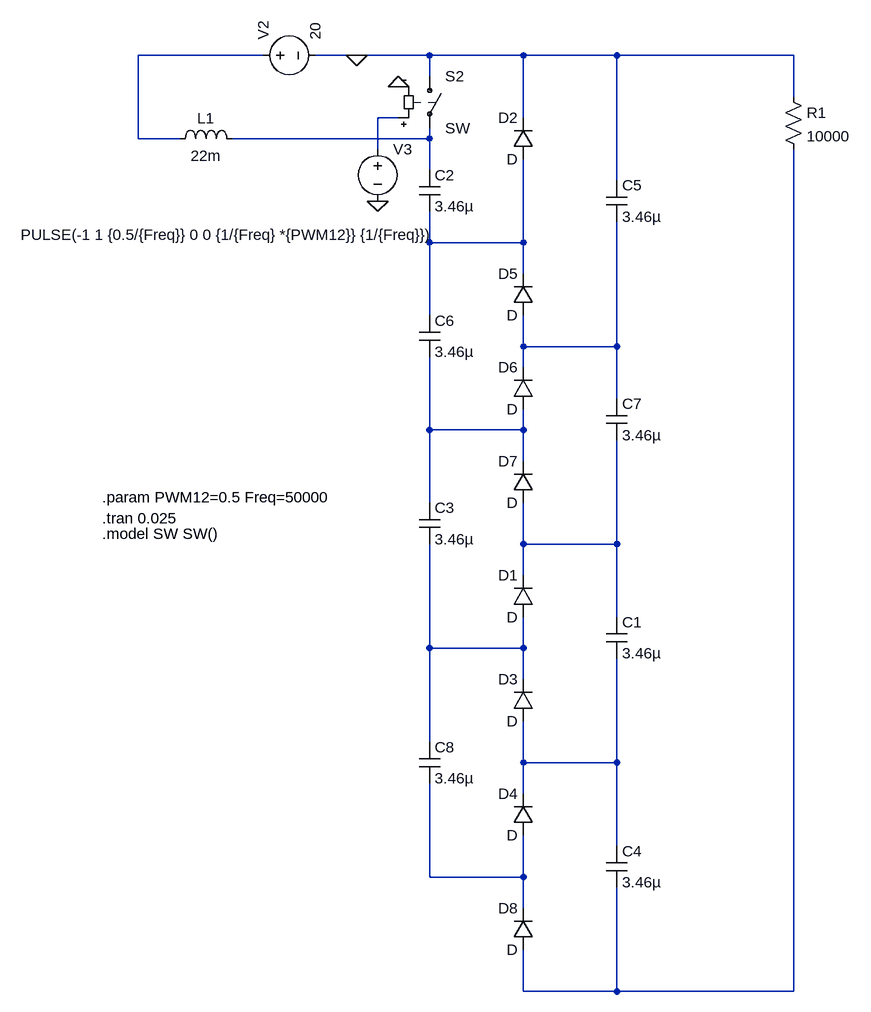
[diagram p0: schematic 3Nxsingleinvert.asc]
3Nxsingleinvert.asc, the LTspice schematic file:
Version 4
SHEET 1 1520 2424
WIRE 192 976 0 976
WIRE 336 976 272 976
WIRE 448 976 336 976
WIRE 592 976 448 976
WIRE 736 976 592 976
WIRE 1008 976 736 976
WIRE 448 1008 448 976
WIRE 1008 1040 1008 976
WIRE 400 1072 368 1072
WIRE 592 1072 592 976
WIRE 0 1104 0 976
WIRE 64 1104 0 1104
WIRE 448 1104 448 1088
WIRE 448 1104 144 1104
WIRE 368 1120 368 1072
WIRE 448 1152 448 1104
WIRE 736 1168 736 976
WIRE 448 1264 448 1216
WIRE 592 1264 592 1136
WIRE 592 1264 448 1264
WIRE 592 1312 592 1264
WIRE 448 1376 448 1264
WIRE 592 1424 592 1376
WIRE 736 1424 736 1232
WIRE 736 1424 592 1424
WIRE 592 1456 592 1424
WIRE 736 1504 736 1424
WIRE 448 1552 448 1440
WIRE 592 1552 592 1520
WIRE 592 1552 448 1552
WIRE 592 1600 592 1552
WIRE 448 1664 448 1552
WIRE 592 1728 592 1664
WIRE 736 1728 736 1568
WIRE 736 1728 592 1728
WIRE 592 1776 592 1728
WIRE 736 1840 736 1728
WIRE 448 1888 448 1728
WIRE 592 1888 592 1840
WIRE 592 1888 448 1888
WIRE 592 1936 592 1888
WIRE 448 2032 448 1888
WIRE 592 2064 592 2000
WIRE 736 2064 736 1904
WIRE 736 2064 592 2064
WIRE 592 2112 592 2064
WIRE 736 2192 736 2064
WIRE 448 2240 448 2096
WIRE 592 2240 592 2176
WIRE 592 2240 448 2240
WIRE 592 2288 592 2240
WIRE 592 2416 592 2352
WIRE 736 2416 736 2256
WIRE 736 2416 592 2416
WIRE 1008 2416 1008 1120
WIRE 1008 2416 736 2416
FLAG 400 1024 0
FLAG 336 976 0
FLAG 368 1200 0
SYMBOL voltage 176 976 R270
WINDOW 123 0 0 Left 2
WINDOW 39 0 0 Left 2
SYMATTR InstName V2
SYMATTR Value 20
SYMBOL sw 448 992 R0
SYMATTR InstName S2
SYMBOL ind 48 1120 R270
WINDOW 0 32 56 VTop 2
WINDOW 3 5 56 VBottom 2
SYMATTR InstName L1
SYMATTR Value 22m
SYMBOL cap 432 1152 R0
SYMATTR InstName C2
SYMATTR Value 3.46µ
SYMBOL cap 720 1168 R0
SYMATTR InstName C5
SYMATTR Value 3.46µ
SYMBOL diode 608 1136 R180
WINDOW 0 24 64 Left 2
WINDOW 3 24 0 Left 2
SYMATTR InstName D2
SYMBOL diode 608 1376 R180
WINDOW 0 24 64 Left 2
WINDOW 3 24 0 Left 2
SYMATTR InstName D5
SYMBOL diode 608 1520 R180
WINDOW 0 24 64 Left 2
WINDOW 3 24 0 Left 2
SYMATTR InstName D6
SYMBOL diode 608 1664 R180
WINDOW 0 24 64 Left 2
WINDOW 3 24 0 Left 2
SYMATTR InstName D7
SYMBOL cap 432 1376 R0
SYMATTR InstName C6
SYMATTR Value 3.46µ
SYMBOL cap 720 1504 R0
SYMATTR InstName C7
SYMATTR Value 3.46µ
SYMBOL res 992 1024 R0
SYMATTR InstName R1
SYMATTR Value 10000
SYMBOL voltage 368 1104 R0
WINDOW 3 -549 148 Left 2
WINDOW 123 0 0 Left 2
WINDOW 39 0 0 Left 2
SYMATTR Value PULSE(-1 1 {0.5/{Freq}} 0 0 {1/{Freq} *{PWM12}} {1/{Freq}})
SYMATTR InstName V3
SYMBOL diode 608 1840 R180
WINDOW 0 24 64 Left 2
WINDOW 3 24 0 Left 2
SYMATTR InstName D1
SYMBOL diode 608 2000 R180
WINDOW 0 24 64 Left 2
WINDOW 3 24 0 Left 2
SYMATTR InstName D3
SYMBOL cap 720 1840 R0
SYMATTR InstName C1
SYMATTR Value 3.46µ
SYMBOL cap 432 1664 R0
SYMATTR InstName C3
SYMATTR Value 3.46µ
SYMBOL diode 608 2176 R180
WINDOW 0 24 64 Left 2
WINDOW 3 24 0 Left 2
SYMATTR InstName D4
SYMBOL diode 608 2352 R180
WINDOW 0 24 64 Left 2
WINDOW 3 24 0 Left 2
SYMATTR InstName D8
SYMBOL cap 720 2192 R0
SYMATTR InstName C4
SYMATTR Value 3.46µ
SYMBOL cap 432 2032 R0
SYMATTR InstName C8
SYMATTR Value 3.46µ
TEXT -56 1688 Left 2 !.tran 0.025
TEXT -56 1712 Left 2 !.model SW SW()
TEXT -56 1656 Left 2 !.param PWM12=0.5 Freq=50000

The netlist it stands for:
* 3Nxsingleinvert.asc
V2 N001 0 20
S2 0 N003 N002 0 SW
L1 N001 N003 22m
C2 N003 N004 3.46µ
C5 0 N005 3.46µ
D2 N004 0 D
D5 N005 N004 D
D6 N006 N005 D
D7 N007 N006 D
C6 N004 N006 3.46µ
C7 N005 N007 3.46µ
R1 0 N011 10000
V3 N002 0 PULSE(-1 1 {0.5/{Freq}} 0 0 {1/{Freq} *{PWM12}} {1/{Freq}})
D1 N008 N007 D
D3 N009 N008 D
C1 N007 N009 3.46µ
C3 N006 N008 3.46µ
D4 N010 N009 D
D8 N011 N010 D
C4 N009 N011 3.46µ
C8 N008 N010 3.46µ
.model D D
.lib standard.dio
.tran 0.025
.model SW SW()
.param PWM12=0.5 Freq=50000
.backanno
.end